# Altium schematic sheet Expanders.SchDoc
size A
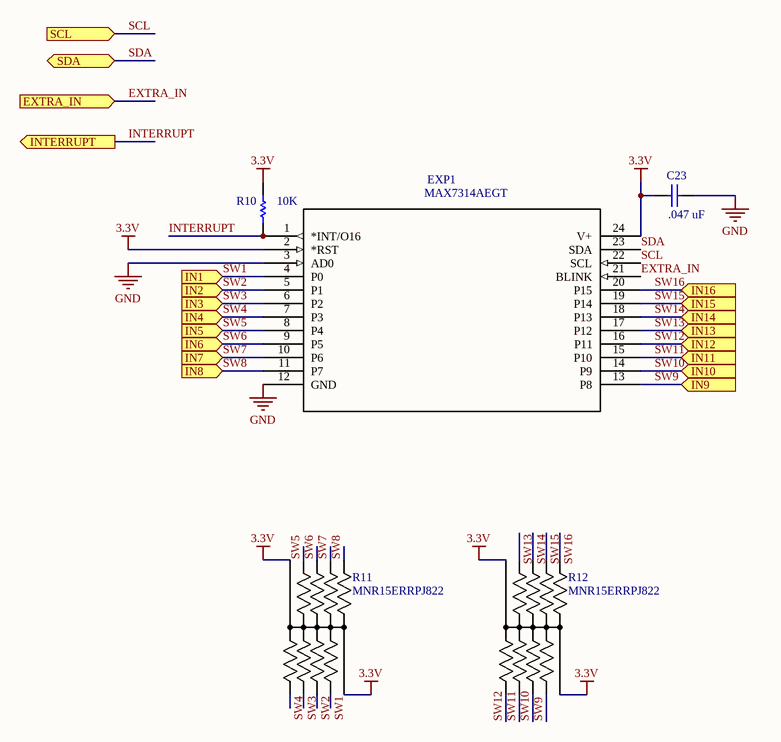
[diagram p0: Expanders.SchDoc]

## Parts
C23  value .047 uF  [C0805]  (hidden comment: Cap)
EXP1  MAX7314AEGT  [21-0055H_24]
R10  value 10K  [6-0805_N]  (hidden comment: R5)
R11  MNR15ERRPJ822  [MNR15]
R12  MNR15ERRPJ822  [MNR15]

## Ports
EXTRA_IN (in), IN1 (in), IN2 (in), IN3 (in), IN4 (in), IN5 (in), IN6 (in), IN7 (in), IN8 (in), IN9 (in), IN10 (in), IN11 (in), IN12 (in), IN13 (in), IN14 (in), IN15 (in), IN16 (in), INTERRUPT (out), SCL (in), SDA

## Nets
3.3V: C23.1 EXP1.2(*RST) EXP1.24(V+) R10.2 R11.5 R11.10 R12.5 R12.10
GND: C23.2 EXP1.3(AD0) EXP1.12(GND)
EXTRA_IN: EXP1.21(BLINK) ; port EXTRA_IN
INTERRUPT: EXP1.1(*INT/O16) R10.1 ; port INTERRUPT
SCL: EXP1.22(SCL) ; port SCL
SDA: EXP1.23(SDA) ; port SDA
SW1: EXP1.4(P0) R11.4 ; port IN1
SW2: EXP1.5(P1) R11.3 ; port IN2
SW3: EXP1.6(P2) R11.2 ; port IN3
SW4: EXP1.7(P3) R11.1 ; port IN4
SW5: EXP1.8(P4) R11.9 ; port IN5
SW6: EXP1.9(P5) R11.8 ; port IN6
SW7: EXP1.10(P6) R11.7 ; port IN7
SW8: EXP1.11(P7) R11.6 ; port IN8
SW9: EXP1.13(P8) R12.4 ; port IN9
SW10: EXP1.14(P9) R12.3 ; port IN10
SW11: EXP1.15(P10) R12.2 ; port IN11
SW12: EXP1.16(P11) R12.1 ; port IN12
SW13: EXP1.17(P12) R12.9 ; port IN13
SW14: EXP1.18(P13) R12.8 ; port IN14
SW15: EXP1.19(P14) R12.7 ; port IN15
SW16: EXP1.20(P15) R12.6 ; port IN16

## Library data of the parts
C23 = Cap: Capacitor; Published: 8-Jun-2000; LatestRevisionDate: 17-Jul-2002; LatestRevisionNote: Re-released for DXP Platform.; PackageReference: RAD-0.3; Publisher: Altium Limited; PackageDescription: Radial Cap, Thru-Hole; 2 Leads; 0.3 in Pin Spacing
EXP1 = MAX7314AEGT: Interface IC - I/O extensions Maxim Integrated MAX7314AEG%2B PWM I%C2%B2C 400 kHz QSOP 24; MP: MAX7314AEG+; Availability: Bad; Price: 2.82 USD; MF: Maxim Integrated; Package: QSOP-24 Maxim Integrated; Value: *
R10 = Res1: Resistor; Published: 8-Jun-2000; LatestRevisionDate: 17-Jul-2002; LatestRevisionNote: Re-released for DXP Platform.; PackageReference: AXIAL-0.3; Publisher: Altium Limited; PackageDescription: Axial Device, Thru-Hole; 2 Leads; 0.3 in Pin Spacing
R11 R12 = MNR15ERRPJ822: Imported; Vendor: ROHM; Value: Value; Manufacturer_Part_Number: MNR15ERRPJ822